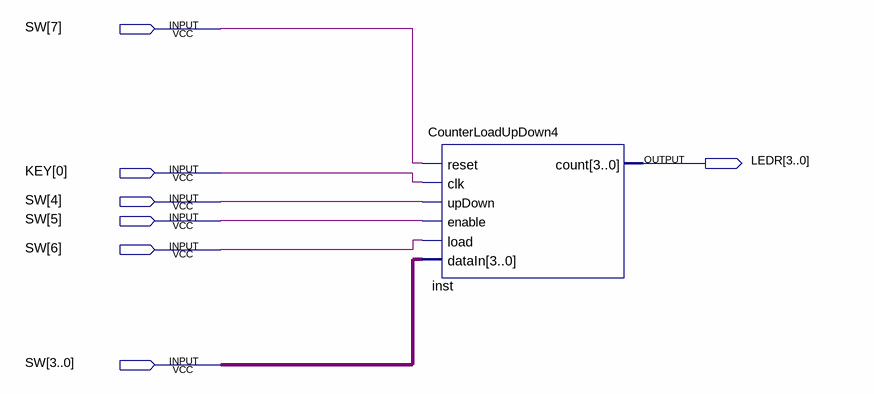
[diagram p0: schematic sheet]
// Quartus schematic Counter_Demo_Load.bdf as structural Verilog: 1 symbols, 7 pins
module Counter_Demo_Load (
  input  [7:0] SW,
  input  [0:0] KEY,
  output [3:0] LEDR
);

  CounterLoadUpDown4 inst (
    .reset(SW[7]), .clk(KEY[0]), .upDown(SW[4]), .enable(SW[5]), .load(SW[6]), .dataIn(SW[3:0]), .count(LEDR));
endmodule
